# EAGLE design BlueSunOFP (EAGLE 7.6.0)

## Sheet 1 of 2
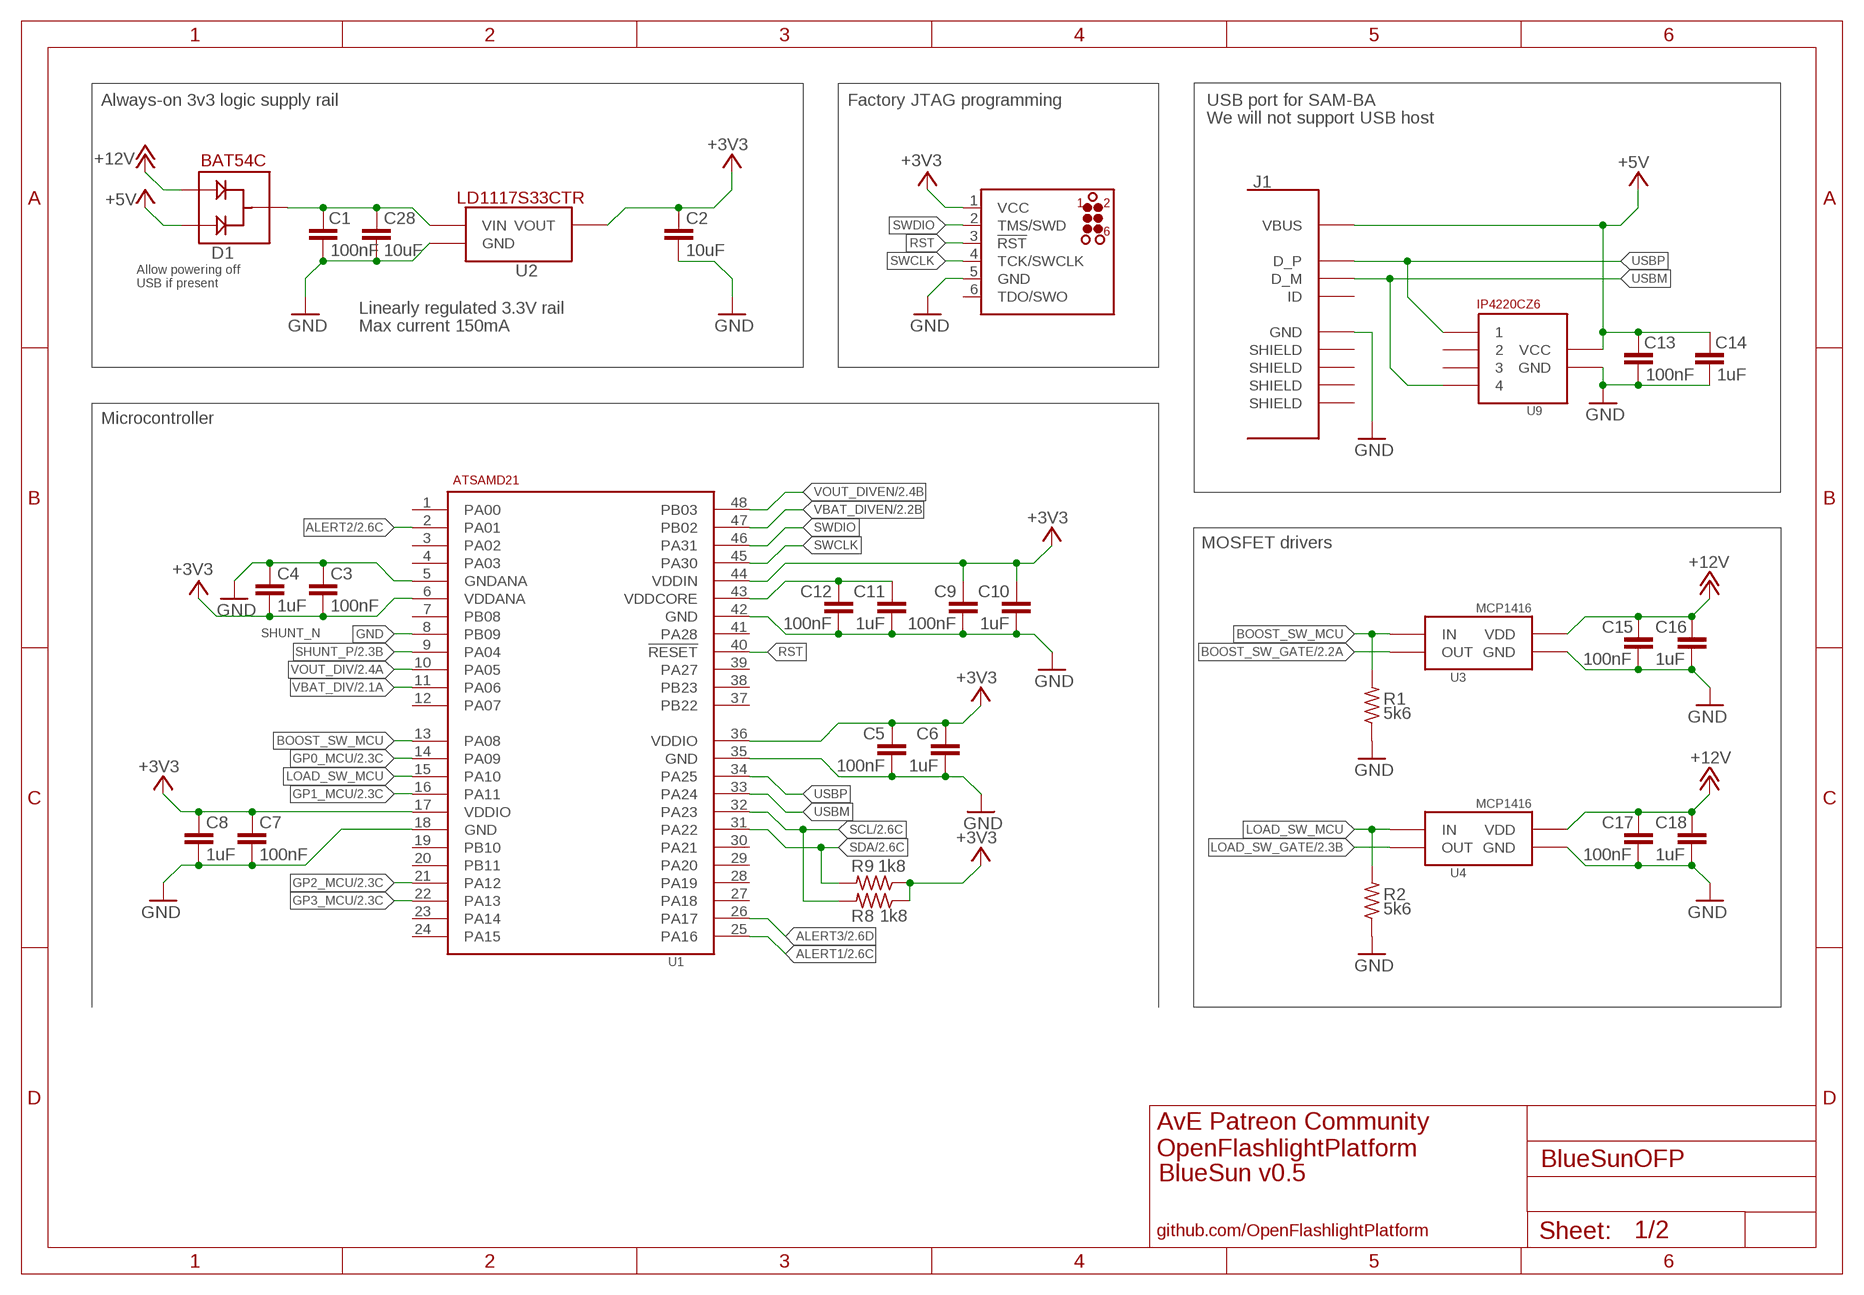
[diagram p0: schematic, sheet 1]

### Parts
C1  100nF  C-EUC0603K  [C0603K]
C2  10uF  C-EUC0603K  [C0603K]
C3  100nF  C-EUC0402K  [C0402K]
C4  1uF  C-EUC0402K  [C0402K]
C5  100nF  C-EUC0402K  [C0402K]
C6  1uF  C-EUC0402K  [C0402K]
C7  100nF  C-EUC0402K  [C0402K]
C8  1uF  C-EUC0402K  [C0402K]
C9  100nF  C-EUC0402K  [C0402K]
C10  1uF  C-EUC0402K  [C0402K]
C11  1uF  C-EUC0402K  [C0402K]
C12  100nF  C-EUC0402K  [C0402K]
C13  100nF  C-EUC0603K  [C0603K]
C14  1uF  C-EUC0603K  [C0603K]
C15  100nF  C-EUC0603K  [C0603K]
C16  1uF  C-EUC0603K  [C0603K]
C17  100nF  C-EUC0603K  [C0603K]
C18  1uF  C-EUC0603K  [C0603K]
C28  10uF  C-EUC0603K  [C0603K]
D1  BAT54C  [SOT23]
J1  USBSMT  [USB_SMT]
R1  5k6  R-US_R0603  [R0603]
R2  5k6  R-US_R0603  [R0603]
R8  1k8  R-US_R0603  [R0603]
R9  1k8  R-US_R0603  [R0603]
U1  SAMD21  [TQFP48]
U2  LD1117S33CTR_3V3_REG  [SOT223]
U3  MCP1416  [SOT23-5]
U4  MCP1416  [SOT23-5]
U9  IP4220CZ6  [SOT457]
U$1  JLINK_CONNECT  [TC2030-MCP-NL]

### Nets
+3V3: C2.1 C3.2 C4.2 C5.1 C6.1 C7.1 C8.1 C9.1 C10.1 R8.1 R9.1 U1.6(VDDANA) U1.17(VDDIO) U1.36(VDDIO) U1.44(VDDIN) U2.2(VOUT) U$1.1(VCC) ; also sheet 2
+5V: C13.1 C14.1 D1.2 J1.1VBUS(VBUS) U9.5(VCC)
+12V: C15.1 C16.1 C17.1 C18.1 D1.1 U3.2(VDD) U4.2(VDD) ; also sheet 2
ALERT1: U1.25(PA16) ; also sheet 2
ALERT2: U1.2(PA01) ; also sheet 2
ALERT3: U1.26(PA17) ; also sheet 2
BOOST_SW_GATE: U3.5(OUT) ; also sheet 2
BOOST_SW_MCU: R1.2 U1.13(PA08) U3.3(IN)
GND: C1.2 C2.2 C3.1 C4.1 C5.2 C6.2 C7.2 C8.2 C9.2 C10.2 C11.2 C12.2 C13.2 C14.2 C15.2 C16.2 C17.2 C18.2 C28.2 J1.5GND(GND) R1.1 R2.1 U1.5(GNDANA) U1.8(PB09) U1.18(GND) U1.35(GND) U1.42(GND) U2.1(GND) U3.4(GND) U4.4(GND) U9.2(GND) U$1.5(GND) ; also sheet 2
GP0_MCU: U1.14(PA09) ; also sheet 2
GP1_MCU: U1.16(PA11) ; also sheet 2
GP2_MCU: U1.21(PA12) ; also sheet 2
GP3_MCU: U1.22(PA13) ; also sheet 2
LOAD_SW_GATE: U4.5(OUT) ; also sheet 2
LOAD_SW_MCU: R2.2 U1.15(PA10) U4.3(IN)
N$1: C11.1 C12.1 U1.43(VDDCORE)
N$2: C1.1 C28.1 D1.3(NEG) U2.3(VIN)
RST: U1.40(!RESET!) U$1.3(!RST!)
SCL: R8.2 U1.32(PA23) ; also sheet 2
SDA: R9.2 U1.31(PA22) ; also sheet 2
SHUNT_P: U1.9(PA04) ; also sheet 2
SWCLK: U1.45(PA30) U$1.4(TCK/SWCLK)
SWDIO: U1.46(PA31) U$1.2(TMS/SWD)
USBM: J1.2D-(D_M) U1.33(PA24) U9.6
USBP: J1.3D+(D_P) U1.34(PA25) U9.1
VBAT_DIV: U1.11(PA06) ; also sheet 2
VBAT_DIVEN: U1.47(PB02) ; also sheet 2
VOUT_DIV: U1.10(PA05) ; also sheet 2
VOUT_DIVEN: U1.48(PB03) ; also sheet 2
Unconnected: J1.4ID(ID) J1.SHIELD@1(SHIELD) J1.SHIELD@2(SHIELD) J1.SHIELD@3(SHIELD) J1.SHIELD@4(SHIELD) U1.1(PA00) U1.3(PA02) U1.4(PA03) U1.7(PB08) U1.12(PA07) U1.19(PB10) U1.20(PB11) U1.23(PA14) U1.24(PA15) U1.27(PA18) U1.28(PA19) U1.29(PA20) U1.30(PA21) U1.37(PB22) U1.38(PB23) U1.39(PA27) U1.41(PA28) U9.3 U9.4 U$1.6(TDO/SWO)

### Notes on the sheet
- Always-on 3v3 logic supply rail | Factory JTAG programming | USB port for SAM-BA
- We will not support USB host
- Allow powering off
  USB if present
- Linearly regulated 3.3V rail
- Max current 150mA
- Microcontroller
- MOSFET drivers
- SHUNT_N
- AvE Patreon Community
- OpenFlashlightPlatform
- BlueSun v0.5
- github.com/OpenFlashlightPlatform

## Sheet 2 of 2
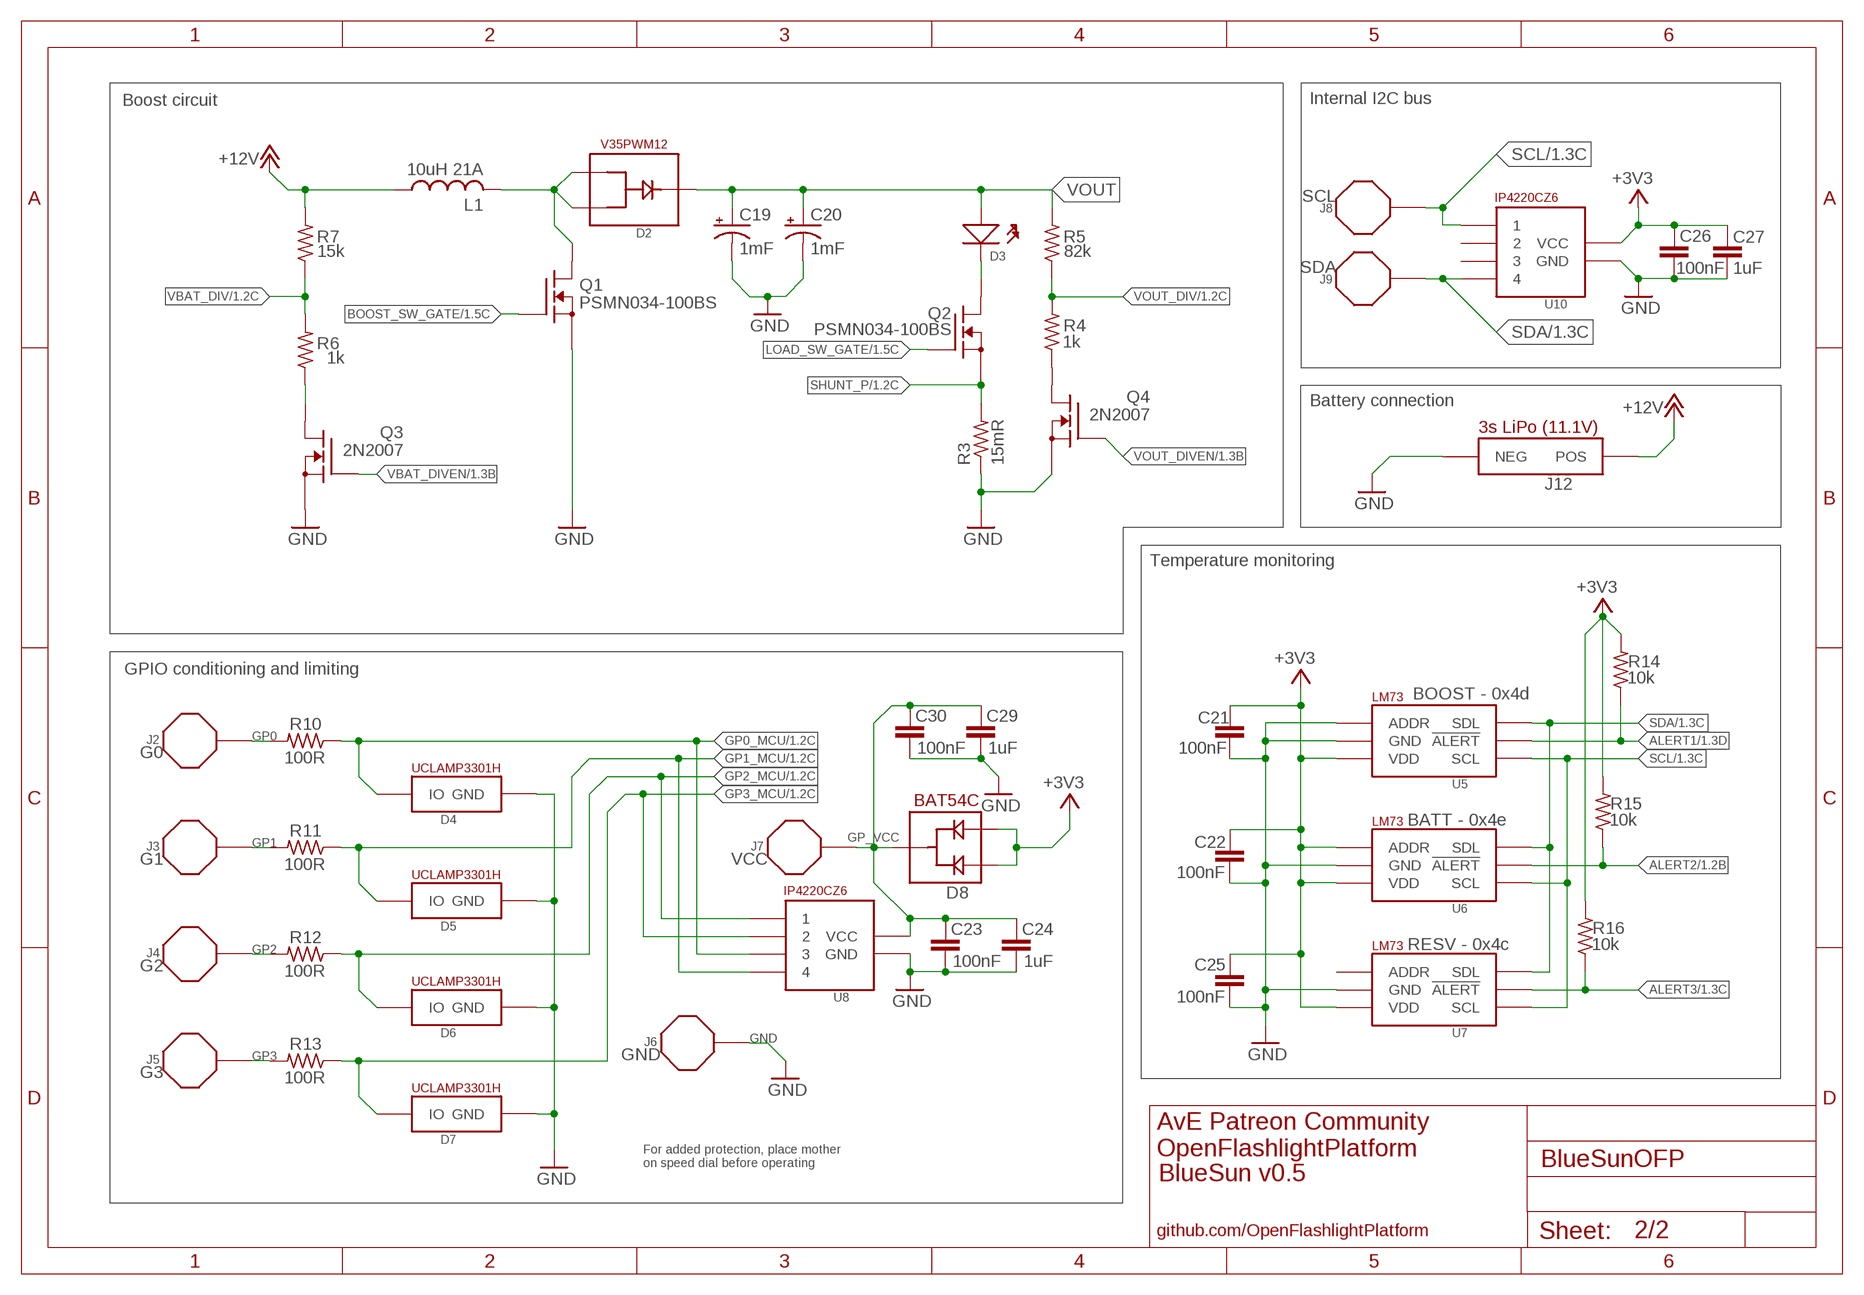
[diagram p1: schematic, sheet 2]

### Parts
C19  1mF  10MMCAP  [10MMCAP]
C20  1mF  10MMCAP  [10MMCAP]
C21  100nF  C-EUC0603K  [C0603K]
C22  100nF  C-EUC0603K  [C0603K]
C23  100nF  C-EUC0603K  [C0603K]
C24  1uF  C-EUC0603K  [C0603K]
C25  100nF  C-EUC0603K  [C0603K]
C26  100nF  C-EUC0603K  [C0603K]
C27  1uF  C-EUC0603K  [C0603K]
C29  1uF  C-EUC0603K  [C0603K]
C30  100nF  C-EUC0603K  [C0603K]
D2  DIODE  [SLIMPAK]
D3  CREE_COB  [CREE_WIRE_MOUNT]
D4  UCLAMP3301H  [SOD523]
D5  UCLAMP3301H  [SOD523]
D6  UCLAMP3301H  [SOD523]
D7  UCLAMP3301H  [SOD523]
D8  BAT54C  [SOT23]
J2  G0  EXT_PIN  [EXT_PIN]
J3  G1  EXT_PIN  [EXT_PIN]
J4  G2  EXT_PIN  [EXT_PIN]
J5  G3  EXT_PIN  [EXT_PIN]
J6  GND  EXT_PIN  [EXT_PIN]
J7  VCC  EXT_PIN  [EXT_PIN]
J8  SCL  EXT_PIN  [EXT_PIN]
J9  SDA  EXT_PIN  [EXT_PIN]
J12  BATTERY  [CREE_WIRE_MOUNT]
L1  10uH 21A  INDUCTOR  [INDUCTOR]
Q1  PSMN034-100BS  MOSFET  [D2PAK]
Q2  PSMN034-100BS  MOSFET  [D2PAK]
Q3  2N2007  SMALL_MOSFET  [SOT23]
Q4  2N2007  SMALL_MOSFET  [SOT23]
R3  15mR  R-US_R2512  [R2512]
R4  1k  R-US_R0603  [R0603]
R5  82k  R-US_R0603  [R0603]
R6  1k  R-US_R0603  [R0603]
R7  15k  R-US_R0603  [R0603]
R10  100R  R-US_R0603  [R0603]
R11  100R  R-US_R0603  [R0603]
R12  100R  R-US_R0603  [R0603]
R13  100R  R-US_R0603  [R0603]
R14  10k  R-US_R0603  [R0603]
R15  10k  R-US_R0603  [R0603]
R16  10k  R-US_R0603  [R0603]
U5  LM73  [SOT23-6]
U6  LM73  [SOT23-6]
U7  LM73  [SOT23-6]
U8  IP4220CZ6  [SOT457]
U10  IP4220CZ6  [SOT457]

### Nets
+3V3: C21.1 C22.1 C25.1 C26.1 C27.1 D8.1 D8.2 R14.2 R15.2 R16.2 U5.3(VDD) U6.1(ADDR) U6.3(VDD) U7.3(VDD) U10.5(VCC) ; also sheet 1
+12V: J12.POS L1.P$1 R7.2 ; also sheet 1
ALERT1: R14.1 U5.5(!ALERT!) ; also sheet 1
ALERT2: R15.1 U6.5(!ALERT!) ; also sheet 1
ALERT3: R16.1 U7.5(!ALERT!) ; also sheet 1
BOOST_SW_GATE: Q1.1(G) ; also sheet 1
GND: C19.NEG(-) C20.NEG(-) C21.2 C22.2 C23.2 C24.2 C25.2 C26.2 C27.2 C29.2 C30.2 D4.NOLINE(GND) D5.NOLINE(GND) D6.NOLINE(GND) D7.NOLINE(GND) J6.P$1 J12.NEG Q1.3(S) Q3.2(S) Q4.2(S) R3.1 U5.1(ADDR) U5.2(GND) U6.2(GND) U7.2(GND) U8.2(GND) U10.2(GND) ; also sheet 1
GP0: J2.P$1 R10.2
GP0_MCU: D4.LINE(IO) R10.1 U8.4 ; also sheet 1
GP1: J3.P$1 R11.2
GP1_MCU: D5.LINE(IO) R11.1 U8.6 ; also sheet 1
GP2: J4.P$1 R12.2
GP2_MCU: D6.LINE(IO) R12.1 U8.1 ; also sheet 1
GP3: J5.P$1 R13.2
GP3_MCU: D7.LINE(IO) R13.1 U8.3 ; also sheet 1
GP_VCC: C23.1 C24.1 C29.1 C30.1 D8.3(NEG) J7.P$1 U8.5(VCC)
LOAD_SW_GATE: Q2.1(G) ; also sheet 1
N$3: D2.1 D2.2 L1.P$2 Q1.2(D)
N$5: D3.NEG Q2.2(D)
N$6: Q3.3(D) R6.1
N$7: Q4.3(D) R4.1
SCL: J8.P$1 U5.4(SCL) U6.4(SCL) U7.4(SCL) U10.1 ; also sheet 1
SDA: J9.P$1 U5.6(SDL) U6.6(SDL) U7.6(SDL) U10.6 ; also sheet 1
SHUNT_P: Q2.3(S) R3.2 ; also sheet 1
VBAT_DIV: R6.2 R7.1 ; also sheet 1
VBAT_DIVEN: Q3.1(G) ; also sheet 1
VOUT: C19.POS(+) C20.POS(+) D2.K D3.POS R5.2
VOUT_DIV: R4.2 R5.1 ; also sheet 1
VOUT_DIVEN: Q4.1(G) ; also sheet 1
Unconnected: U7.1(ADDR) U10.3 U10.4

### Notes on the sheet
- Boost circuit | Internal I2C bus
- Battery connection
- Temperature monitoring
- GPIO conditioning and limiting
- BOOST - 0x4d
- BATT - 0x4e
- RESV - 0x4c
- AvE Patreon Community
- OpenFlashlightPlatform
- For added protection, place mother
  on speed dial before operating
- BlueSun v0.5
- github.com/OpenFlashlightPlatform

## Library data of the parts
C1-C18 C21-C30 = rcl:C-EU: CAPACITOR, European symbol
C19 C20 = flashlight:10MMCAP
D1 D8 = flashlight:BAT54C
D2 = flashlight:DIODE
D3 = flashlight:CREE_COB
D4-D7 = flashlight:UCLAMP3301H
J1 = flashlight:USB
J2-J9 = flashlight:EXT_PIN
J12 = flashlight:BATTERY
L1 = flashlight:INDUCTOR
Q1 Q2 = flashlight:MOSFET
Q3 Q4 = flashlight:SMALL_MOSFET
R1-R16 = rcl:R-US_: RESISTOR, American symbol
U1 = flashlight:SAMD21
U2 = flashlight:LD1117S33CTR_3V3_REG
U3 U4 = flashlight:MCP1416
U5-U7 = flashlight:LM73
U8-U10 = flashlight:IP4220CZ6
U$1 = flashlight:JLINK_CONNECT

## Board
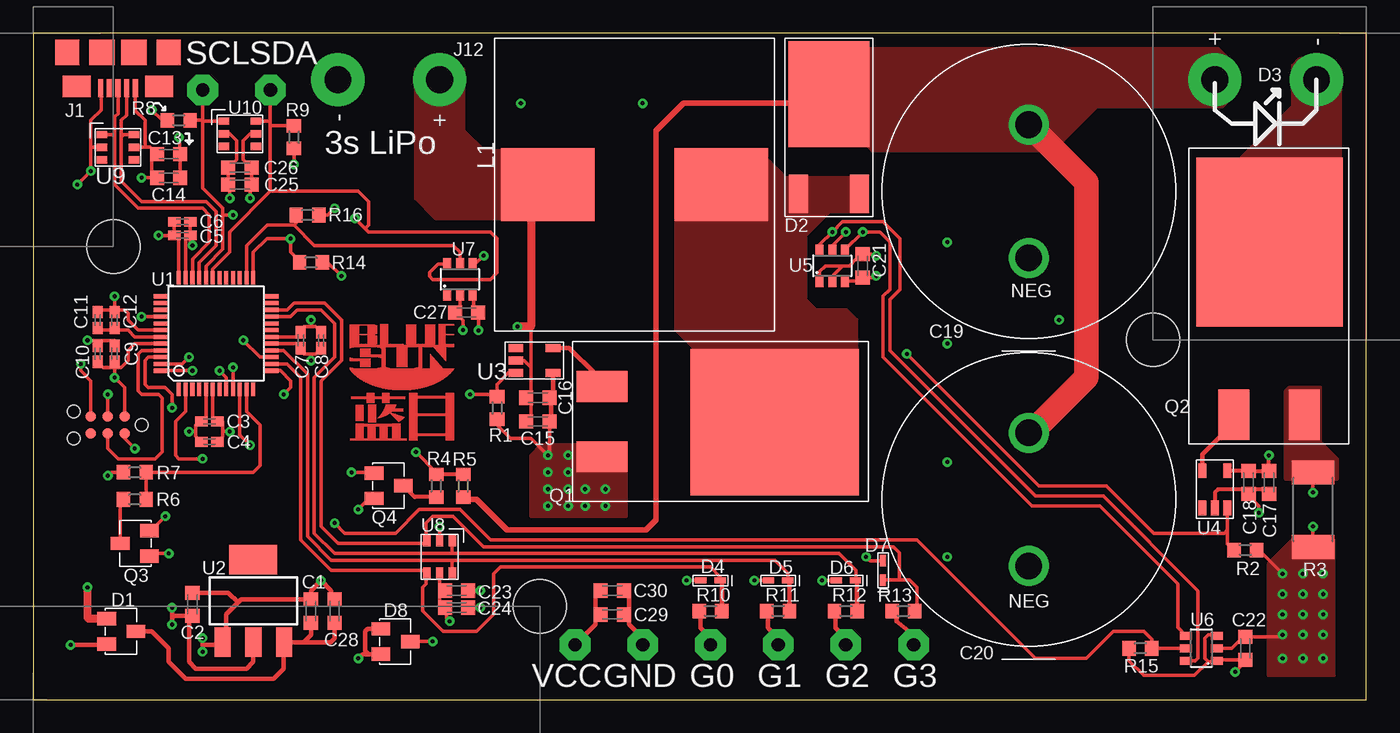
[diagram p2: board, top side]
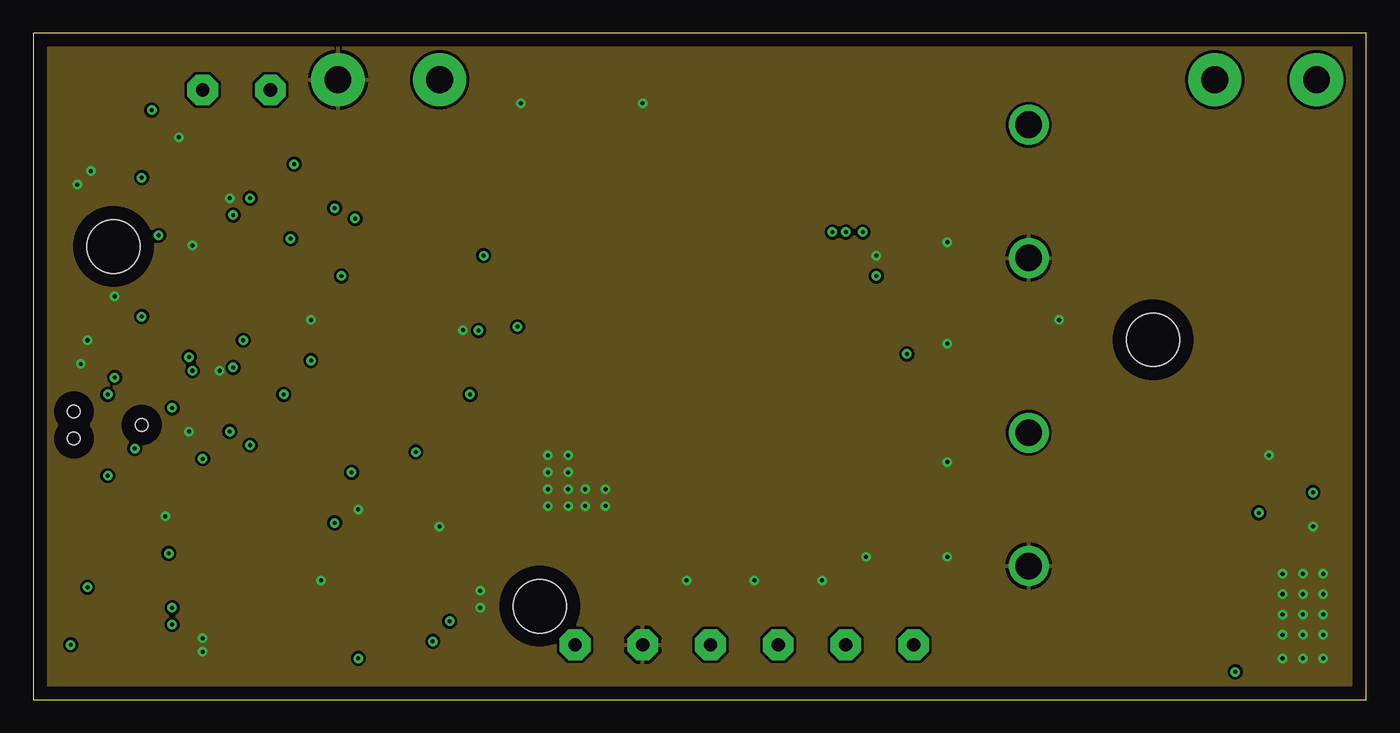
[diagram p3: board, inner layer Route2]
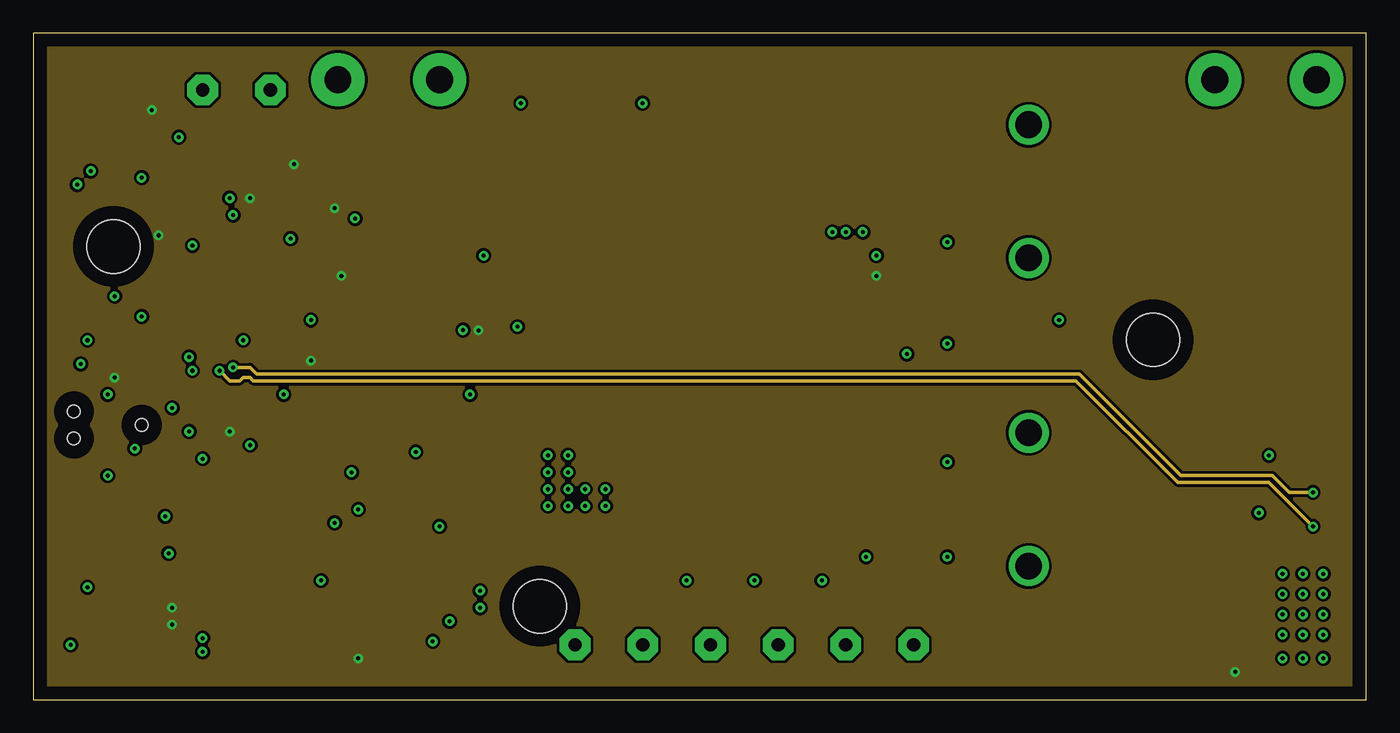
[diagram p4: board, inner layer Route15]
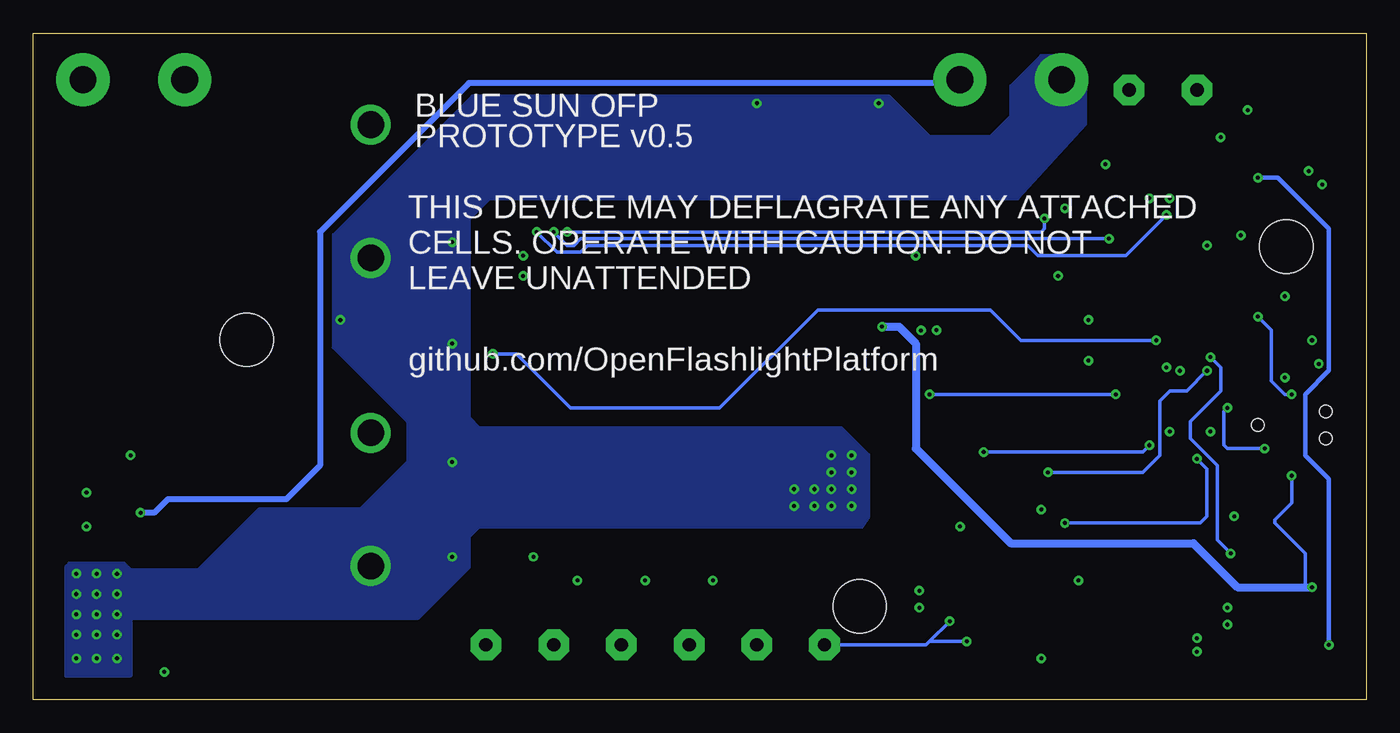
[diagram p5: board, bottom side, seen from below]

Size 100 x 50 mm. Coordinates in mm from the lower left corner, seen from the top.
Outline: 0,0 100,0 100,50 0,50 0,0
Copper layers (1*2*15*16): Top 0.035mm / dielectric 1.5mm / Route2 0.035mm / dielectric 0.15mm / Route15 0.035mm / dielectric 0.2mm / Bottom 0.035mm
Design rules "default *": minimum track width 10mil, minimum drill 12mil, track to track 8mil, track to pad 8mil, pad to pad 8mil, via to via 8mil, smd to smd 0mil, copper to edge 40mil, drill to drill 8mil, minimum pad ring 10mil, minimum via ring 8mil, stop-mask expansion 4mil, vias tented up to drill 12mil, thermal gap 10mil
Holes 4 mm at 6,34 38,7 84,27

### Footprints (pad centres in the part's own frame; a part is rotated, then mirrored left to right if it is on the bottom)
C0603K = smd 1.05 x 1.08: 1 -0.875,0; 2 0.875,0
C0402K = smd 0.925 x 0.74: 1 -0.6,0; 2 0.6,0
10MMCAP = drill 2: NEG 5,0; POS -5,0
SOT23 = smd 1 x 1.4: 1 -0.95,-1.1; 2 0.95,-1.1; 3 0,1.1
SLIMPAK = smd 1.4 x 2.9: 1 -2.29,-3.48; 2 2.29,-3.48 | smd 6.1 x 7.97: K 0,4
CREE_WIRE_MOUNT = drill 2 pad 4: NEG 0,-7.62; POS 0,0
SOD523 = smd 0.85 x 0.45: LINE -0.725,0; NOLINE 0.725,0
USB_SMT = smd 0.4 x 1.35: 1VBUS -1.3,2.675; 2D- -0.65,2.675; 3D+ 0,2.675; 4ID 0.65,2.675; 5GND 1.3,2.675 | smd 2.1 x 1.6: SHIELD@1 -3.1,2.55; SHIELD@6 3.1,2.55 | smd 1.8 x 1.9: SHIELD@2 -3.8,0; SHIELD@5 3.8,0 | smd 1.9 x 1.9: SHIELD@3 -1.2,0; SHIELD@4 1.2,0
EXT_PIN = drill 1 pad 2.3 octagon: P$1 0,0
INDUCTOR = smd 5.5 x 7: P$1 0,0; P$2 0,13
D2PAK = smd 2.32 x 3.81: 1 -2.64,0; 3 2.64,0 | smd 11 x 12.65: 2 0.05,12.953
R0603 = smd 1 x 1.1: 1 -0.85,0; 2 0.85,0
R2512 = smd 1.8 x 3.2: 1 -2.8,0; 2 2.8,0
TQFP48 = smd 1.016 x 0.305: 1 -4.191,2.794; 2 -4.191,2.286; 3 -4.191,1.778; 4 -4.191,1.27; 5 -4.191,0.762; 6 -4.191,0.254; 7 -4.191,-0.254; 8 -4.191,-0.762; 9 -4.191,-1.27; 10 -4.191,-1.778; 11 -4.191,-2.286; 12 -4.191,-2.794; 25 4.191,-2.794; 26 4.191,-2.286; 27 4.191,-1.778; 28 4.191,-1.27; 29 4.191,-0.762; 30 4.191,-0.254; 31 4.191,0.254; 32 4.191,0.762; 33 4.191,1.27; 34 4.191,1.778; 35 4.191,2.286; 36 4.191,2.794 | smd 0.305 x 1.016: 13 -2.794,-4.191; 14 -2.286,-4.191; 15 -1.778,-4.191; 16 -1.27,-4.191; 17 -0.762,-4.191; 18 -0.254,-4.191; 19 0.254,-4.191; 20 0.762,-4.191; 21 1.27,-4.191; 22 1.778,-4.191; 23 2.286,-4.191; 24 2.794,-4.191; 37 2.794,4.191; 38 2.286,4.191; 39 1.778,4.191; 40 1.27,4.191; 41 0.762,4.191; 42 0.254,4.191; 43 -0.254,4.191; 44 -0.762,4.191; 45 -1.27,4.191; 46 -1.778,4.191; 47 -2.286,4.191; 48 -2.794,4.191
SOT223 = smd 1.219 x 2.235: 1 -2.311,-3.099; 2 0,-3.099; 3 2.311,-3.099 | smd 3.6 x 2.2: 4 0,3.099
SOT23-5 = smd 0.6 x 1.1: 1 -0.95,-1.4; 2 0,-1.4; 3 0.95,-1.4; 4 0.95,1.4; 5 -0.95,1.4
SOT23-6 = smd 0.6 x 0.9: 1 -0.95,-1.15; 2 0,-1.15; 3 0.95,-1.15; 4 0.95,1.15; 5 0,1.15; 6 -0.95,1.15
SOT457 = smd 0.8 x 0.55: 1 -1.2,0.95; 2 -1.2,0; 3 -1.2,-0.95; 4 1.2,-0.95; 5 1.2,0; 6 1.2,0.95
TC2030-MCP-NL = smd 0.787 x 0.787: 1 1.27,-0.635; 2 1.27,0.635; 3 2.54,-0.635; 4 2.54,0.635; 5 3.81,-0.635; 6 3.81,0.635 | hole 0.95: 0,0; 5.08,-1.016; 5.08,1.016

### Placement (x,y rotation side)
C1  20.83,6.64 90 top
C2  11.94,7.15 90 top
C3  13.21,20.87 0 top
C4  13.21,19.34 0 top
C5  11.18,34.84 0 top
C6  11.18,35.85 0 top
C7  20.07,26.96 90 top
C8  21.59,26.96 90 top
C9  6.1,25.95 90 top
C10  4.83,25.95 90 top
C11  4.83,28.49 90 top
C12  6.1,28.49 90 top
C13  10.16,40.93 0 top
C14  10.16,39.15 0 top
C15  37.85,20.87 0 top
C16  37.85,22.64 0 top
C17  92.71,16.29 90 top
C18  91.19,16.29 90 top
C19  74.68,38.14 270 top
C20  74.68,15.02 270 top
C21  62.23,32.55 90 top
C22  90.93,3.85 90 top
C23  31.75,8.17 0 top
C24  31.75,6.9 0 top
C25  15.49,38.65 180 top
C26  15.49,39.92 180 top
C27  32.51,29.04 180 top
C28  22.61,6.64 90 top
C29  43.43,6.39 0 top
C30  43.43,8.17 0 top
D1  6.6,5.12 270 top
D2  59.69,41.44 0 top
D3  88.65,46.52 90 top
D4  50.8,8.93 180 top
D5  55.88,8.93 180 top
D6  60.96,8.93 180 top
D7  63.75,9.69 90 top
D8  27.18,4.36 270 top
J1  6.35,48.55 180 top
J2  50.8,4.1 90 top
J3  55.88,4.1 90 top
J4  60.96,4.1 90 top
J5  66.04,4.1 90 top
J6  45.72,4.1 90 top
J7  40.64,4.1 90 top
J8  12.7,45.76 90 top
J9  17.78,45.76 90 top
J12  30.48,46.52 270 top
L1  38.61,38.65 270 top
Q1  42.67,20.87 270 top
Q2  92.71,21.37 0 top
Q3  7.62,11.72 90 top
Q4  26.67,16.04 270 top
R1  34.8,21.88 90 top
R2  90.93,11.21 180 top
R3  96.01,14.26 90 top
R4  30.23,16.04 90 top
R5  32.26,16.04 270 top
R6  7.62,15.02 0 top
R7  7.62,17.06 180 top
R8  10.92,43.47 0 top
R9  19.56,42.2 90 top
R10  50.8,6.64 180 top
R11  55.88,6.64 180 top
R12  60.96,6.64 180 top
R13  65.28,6.64 180 top
R14  20.83,32.8 0 top
R15  83.06,3.85 180 top
R16  20.57,36.36 0 top
U1  13.72,27.47 90 top
U2  16.51,7.4 0 top
U3  37.59,25.44 270 top
U4  88.65,15.79 0 top
U5  59.94,32.55 0 top
U6  87.63,3.85 90 top
U7  32,31.53 0 top
U8  30.48,10.71 270 top
U9  6.35,41.44 0 top
U10  15.49,42.46 0 top
U$1  8.13,20.61 180 top

### Tracks (layer width: path | path; a pad name or v marks a point on that pad's centre or on a via)
+3V3  (via drill 0.3)
  Top 0.254: 14.22,20.1 14.22,20.87 C3.2 13.46,21.21 U1.6 | 14.22,20.1 14.22,19.76 C4.2 | v14.73,20.1 14.22,20.1 | U1.44 7.62,26.71 7.11,26.2 7.11,25.44 6.6,24.93 6.1,24.93 | 6.1,24.93 5.24,24.93 C10.1 | 6.1,24.93 C9.1 v6.1,24.17 6.86,23.41 U$1.1 | U1.17 19.72,26.71 C7.1 20.07,26.2 20.32,25.95 20.83,25.95 | 20.83,25.95 21.17,25.95 C8.1 | v20.83,25.44 20.83,25.95 | U1.36 10.92,34.84 C5.1 | U5.3 61.95,31.4 C21.1 63.13,31.67 v63.25,31.79 | 88.14,2.83 88.71,2.83 U6.1 88.86,2.97 C22.1 90.93,2.83 v90.17,2.07 | R15.2 82.21,2.92 83.31,1.82 87.12,1.82 88.14,2.83 | 88.14,2.83 87.88,3.09 87.88,4.61 88.14,4.86 88.71,4.86 U6.3 | U10.5 16.26,42.46 15.75,41.95 15.75,40.54 C26.1 C25.1 16.26,38.53 v16.26,37.63 | C5.1 v9.4,34.84 | C5.1 C6.1 | R8.1 9.65,43.47 v8.89,44.23 | R9.1 v19.56,40.17 | U7.3 33.02,30.32 33.02,28.99 33.27,28.74 C27.1 33.4,28.6 v33.4,27.7 | R14.2 22.1,32.8 v23.11,31.79 | R16.2 22.1,36.36 v22.61,36.87
  Top 0.356: U2.2 16.51,2.83 16,2.32 12.19,2.32 11.68,2.83 11.68,6.02 C2.1 10.55,6.27 10.41,6.13 | 10.41,6.13 v10.41,5.63 | 10.41,6.13 v10.41,6.9 | D8.2 25.15,3.41 | 25.15,3.41 24.7,3.41 v24.38,3.09 | D8.1 25.08,5.31 24.89,5.12 24.89,3.66 25.15,3.41
  pour Route15: 0.25,49.82 100.08,50.08 100.84,0.04 0.25,0.04
+5V  (via drill 0.3)
  Top 0.254: J1.1VBUS 7.65,44.2 8.38,43.47 8.38,41.44 U9.5 8.78,41.44 C13.1 9.29,40.82 8.89,40.42 8.89,39.55 C14.1 v8.13,39.15
  Top 0.356: v2.79,4.1 5.44,4.1 D1.2
  Bottom 0.356: v8.13,39.15 6.62,39.15 2.79,35.33 2.79,24.68 4.57,22.9 4.57,18.33 2.79,16.55 v2.79,4.1
+12V  (via drill 0.3)
  Top 0.254: 90.68,15.79 91.95,14.52 v91.95,14.01 | U3.2 36.83,25.44 37.34,24.93 | 37.34,24.93 37.34,23.01 C16.1 37.34,22.64 37.34,21.23 C15.1 | L1.P$1 38.61,37.38 37.59,36.36 37.34,36.36 37.08,36.11 | 37.34,27.98 37.34,24.93 | R7.2 5.84,17.06 v5.59,16.8
  Top 0.305: U4.2 88.65,15.53 88.9,15.79 90.68,15.79 91.05,15.42 C18.1 91.55,15.79 92.46,15.79 92.71,15.53 C17.1
  Top 0.61: 37.34,36.36 37.34,27.98 v36.32,27.98 | D1.1 4.13,6.07 4.06,6.13 v4.06,8.42
  Bottom 0.254: v5.59,16.8 5.59,14.77 6.86,13.5 6.86,13.25 4.57,10.96 4.57,8.42 | 30.48,46.27 J12.POS
  Bottom 0.457: 30.48,46.27 67.31,46.27 78.49,35.09 78.49,17.56 81.03,15.02 89.92,15.02 90.93,14.01 v91.95,14.01
  Bottom 0.61: v36.32,27.98 35.05,27.98 33.78,26.71 33.78,18.83 26.67,11.72 12.95,11.72 9.65,8.42 4.57,8.42 v4.06,8.42
  pour Top (no thermals): 29.46,48.04 31.5,48.04 32.26,47.28 32.26,42.71 33.78,41.19 41.4,41.19 41.91,40.68 41.91,36.61 41.4,36.11 30.23,36.11 28.7,37.63 28.7,47.28
ALERT1  (via drill 0.3)
  Top 0.254: U5.5 59.94,34.07 v60.96,35.09 | U1.25 16.51,33.57 17.53,34.58 v19.3,34.58 19.3,33.57 19.98,32.89 R14.1
  Bottom 0.254: v60.96,35.09 59.94,34.07 59.44,34.07 58.93,34.58 v19.3,34.58
ALERT2  (via drill 0.3)
  Top 0.254: U6.5 R15.1 83.91,4.52 83.31,5.12 81.03,5.12 78.99,3.09 75.18,3.09 66.29,11.98 34.29,11.98 32,14.26 28.96,14.26 27.18,12.48 23.37,12.48 v22.61,13.25 | v12.7,18.07 10.92,18.07 10.67,18.33 10.67,20.87 11.43,21.63 U1.2
  Bottom 0.254: v22.61,13.25 12.45,13.25 11.94,13.75 11.94,17.31 v12.7,18.07
ALERT3
  Top 0.254: U1.26 16,34.07 17.53,35.6 19.56,35.6 | U7.5 32,33.57 31.5,34.07 21.08,34.07 19.56,35.6 | R16.1 19.72,35.76 19.56,35.6
BOOST_SW_GATE
  Top 0.356: U3.5 40.2,26.39 42.16,24.42 42.16,24.01 Q1.1
BOOST_SW_MCU  (via drill 0.3)
  Top 0.254: U3.3 35.63,24.49 34.8,23.66 R1.2 34.63,22.9 v32.77,22.9 | U1.13 18.54,24.68 19.3,23.91 19.3,23.41 v18.8,22.9
  Bottom 0.254: v18.8,22.9 v32.77,22.9
GND  (via drill 0.3)
  Top 0.254: 12.19,20.1 12.19,19.76 C4.1 | v11.68,20.1 12.19,20.1 | U1.42 7.87,27.72 7.11,28.49 7.11,28.99 6.86,29.25 6.1,29.25 | 6.1,29.25 4.99,29.25 C11.2 | C12.2 6.1,29.25 | 6.1,29.25 v6.1,30.26 | C9.2 6.1,26.96 4.83,26.96 | 4.83,26.96 v4.06,26.96 | C10.2 4.83,26.96 | U$1.5 4.32,23.91 3.56,24.68 v3.56,25.18 | U1.5 12.95,21.21 C3.1 | C3.1 12.7,20.87 | C3.1 12.45,20.87 12.19,20.61 12.19,20.1 | U1.18 19.72,27.22 C7.2 20.07,27.72 20.32,27.98 20.83,27.98 | 20.83,27.98 21.17,27.98 C8.2 | v20.83,28.49 20.83,27.98 | U1.35 11.43,34.49 C5.2 | U5.2 59.94,31.79 60.71,32.55 | 60.71,32.55 61.21,32.55 61.72,33.06 61.86,33.06 C21.2 62.88,33.42 62.99,33.31 v63.25,33.31 | U5.1 58.99,32.11 59.44,32.55 60.71,32.55 | R2.1 91.95,11.21 v93.73,9.44 | U6.2 89.92,3.85 90.79,4.72 C22.2 93.58,4.72 v93.73,4.86 | R1.1 34.8,20.61 35.81,19.6 37.34,19.6 v38.61,18.33 38.72,18.44 C15.2 | U8.2 v30.48,12.99 | C23.2 v33.53,8.17 | C24.2 v33.53,6.9 | D4.NOLINE v49.02,8.93 | D5.NOLINE v54.1,8.93 | D6.NOLINE v59.18,8.93 | J1.5GND 5.05,45.53 5.08,45.5 5.08,44.23 4.32,43.47 4.32,41.44 | U9.2 4.32,41.44 | 4.32,41.44 v4.32,39.66 v3.3,38.65 | v10.92,42.2 11.04,41.33 C13.2 C14.2 | Q3.2 8.82,12.67 v9.91,13.75 | Q4.2 25.21,15.09 v24.38,14.26 | U10.2 14.73,42.46 15.24,41.95 15.24,40.54 C26.2 C25.2 14.73,38.53 v14.73,37.63 | C5.2 11.78,34.24 v11.94,34.07 | C5.2 C6.2 | U7.2 32,28.99 31.89,28.99 C27.2 32.23,28.45 v32.23,27.72 | D7.NOLINE 62.77,10.41 v62.48,10.71 | U1.8 14.48,24.17 v13.97,24.68 | v96.01,12.99 R3.1
  Top 0.305: U4.4 91.17,17.19 C18.2 C17.2 v92.71,18.33
  Top 0.356: U3.4 38.99,22.92 C16.2 | C16.2 38.72,22.53 38.86,22.39 | C15.2 38.72,20.98 38.86,21.12 38.86,22.5 C16.2 | 12.7,4.1 13.97,4.1 14.2,3.82 U2.1 14.48,4.59 14.48,6.39 15.37,7.28 | 12.7,4.1 v12.7,4.61 | 12.7,4.1 v12.7,3.59 | 15.37,7.28 15.61,7.52 C1.2 20.83,8.17 v21.59,8.93 22.35,8.17 22.35,7.77 C28.2 | C2.2 14.62,8.02 15.37,7.28 | J6.P$1 45.72,4.61 44.7,5.63 44.7,6.39 | 44.7,6.39 44.7,7.77 C30.2 | C29.2 44.7,6.39
  Route15 0.254: v13.97,24.68 14.73,23.91 15.49,23.91 15.75,24.17 16.26,24.17 16.51,23.91 78.23,23.91 85.85,16.29 92.71,16.29 v96.01,12.99
  other vias: 95.25,9.44 96.77,9.44 96.77,7.91 95.25,7.91 93.73,7.91 93.73,6.39 93.73,3.09 95.25,3.09 96.77,3.09 96.77,4.86 95.25,4.86 95.25,6.39 96.77,6.39 36.58,44.74 45.72,44.74 68.58,34.33 68.58,26.71 68.58,17.82 68.58,10.71 76.96,28.49 40.13,18.33 38.61,17.06 40.13,17.06 38.61,15.79 38.61,14.52 40.13,14.52 41.4,14.52 42.93,14.52 42.93,15.79 41.4,15.79 40.13,15.79
  pour Route2: 0.25,49.82 100.08,50.08 100.08,0.04 -0.07,-0.01
  pour Top (no thermals): 94.49,11.98 97.54,11.98 97.54,1.82 92.71,1.82 92.71,10.2
  pour Bottom: 92.71,7.91 92.71,9.69 93.22,10.2 97.28,10.2 97.54,9.94 97.54,1.82 92.71,1.82
  pour Bottom (no thermals): 26.67,46.01 26.67,43.73 28.19,42.2 32.77,42.2 35.81,45.25 67.06,45.25 77.47,34.84 77.47,26.45 71.88,20.87 71.88,17.82 75.44,14.26 83.06,14.26 87.63,9.69 97.54,9.69 97.54,1.82 92.71,1.82 92.71,6.13 71.12,6.13 67.31,9.94 67.31,12.23 66.55,12.99 37.85,12.99 37.34,13.75 37.34,18.33 39.37,20.36 66.55,20.36 67.31,21.12 67.31,36.11 65.79,37.63 26.16,37.63 21.08,43.22 21.08,47.03 22.35,48.3 24.38,48.3
  pour Top (no thermals): 40.89,19.09 44.45,19.09 44.45,17.31 44.45,13.75 37.34,13.75 37.34,18.33 38.1,19.09
GP0
  Top 0.356: J2.P$1 50.8,4.61 50.04,5.37 50.04,6.55 R10.2
GP0_MCU
  Top 0.254: D4.LINE 51.52,9.22 50.8,9.94 35.05,9.94 34.54,9.44 34.54,6.39 33.27,5.12 30.73,5.12 29.21,6.64 29.21,8.42 29.46,8.67 29.46,9.44 U8.4 29.53,9.62 29.46,9.69 22.35,9.69 20.07,11.98 20.07,24.17 19.05,25.18 U1.14
  Top 0.356: R10.1 51.65,8.8 D4.LINE
GP1
  Top 0.356: J3.P$1 55.88,4.61 55.12,5.37 55.12,6.55 R11.2
GP1_MCU
  Top 0.254: D5.LINE 56.6,9.47 55.63,10.45 31.5,10.45 | U8.6 31.43,10.39 31.5,10.45 | 31.5,10.45 22.35,10.45 20.57,12.23 20.57,24.42 18.8,26.2 U1.16
  Top 0.356: R11.1 56.73,8.8 D5.LINE
GP2
  Top 0.356: J4.P$1 60.96,4.61 60.2,5.37 60.2,6.55 R12.2
GP2_MCU
  Top 0.254: R12.1 61.81,8.84 61.72,8.93 61.72,9.69 60.45,10.96 31.5,10.96 | U8.1 31.43,11.03 31.5,10.96 | U1.21 19.3,28.74 19.81,29.25 21.59,29.25 22.61,28.23 22.61,25.69 21.08,24.17 21.08,12.48 22.61,10.96 31.5,10.96
  Top 0.356: R12.1 61.81,8.8 D6.LINE
GP3
  Top 0.356: J5.P$1 66.04,4.86 64.77,5.88 64.77,6.55 R13.2
GP3_MCU
  Top 0.254: 29.46,11.72 29.46,13.25 29.97,13.75 31.5,13.75 33.78,11.47 64.52,11.47 64.99,11 64.99,9 65.02,8.97 | 29.46,11.72 U8.3 29.53,11.79 29.46,11.72 | U1.22 19.05,29.25 19.56,29.76 21.84,29.76 23.11,28.49 23.11,25.44 21.59,23.91 21.59,12.99 22.86,11.72 29.46,11.72 | D7.LINE 65.02,8.97 | 65.02,8.97 65.75,8.97 66.29,8.42 66.29,6.81 R13.1
GP_VCC  (via drill 0.3)
  Top 0.254: U8.5 30.48,8.56 C23.1 30.73,8.17 30.48,7.91 30.48,7.29 C24.1 30.99,6.9 30.99,6.13 v31.24,5.88 | D8.3 v29.97,4.36
  Top 0.356: J7.P$1 42.16,5.63 42.16,6.39 | 42.16,6.39 42.16,7.77 C30.1 | C29.1 42.16,6.39
  Bottom 0.254: v31.24,5.88 32.77,4.36 | J7.P$1 33.02,4.1 32.77,4.36 | v29.97,4.36 32.77,4.36
LOAD_SW_GATE
  Top 0.356: U4.5 87.7,18.39 89.15,19.85 89.15,20.46 Q2.1
LOAD_SW_MCU  (via drill 0.3)
  Top 0.254: 89.6,12.74 89.6,11.7 R2.2 | U1.15 17.02,25.69 v15.75,26.96 | U4.3 89.6,12.74 | v65.53,25.95 75.44,16.04 80.52,16.04 84.07,12.48 89.34,12.48 89.6,12.74
  Bottom 0.254: v15.75,26.96 25.91,26.96 28.19,29.25 41.15,29.25 48.51,21.88 59.69,21.88 63.75,25.95 v65.53,25.95
N$1
  Top 0.254: U1.43 7.62,27.22 7.11,27.72 6.1,27.72 | 6.1,27.72 4.99,27.72 C11.1 | C12.1 6.1,27.72
N$2
  Top 0.356: U2.3 20.27,4.3 20.83,4.86 C1.1 | U2.3 22.3,4.3 22.61,4.61 C28.1 | D1.3 8.89,5.12 10.16,3.85 10.16,2.83 11.43,1.56 18.03,1.56 18.8,2.32 18.8,4.28 U2.3
N$3
  pour Top (no thermals): 48.77,41.19 54.36,41.19 56.39,39.15 62.23,39.15 62.48,38.9 62.48,36.87 62.23,36.61 59.69,36.61 57.91,34.84 57.91,30.01 58.67,29.25 60.96,29.25 61.72,28.49 61.72,20.87 49.78,20.87 49.78,26.2 48.26,27.72 48.26,40.68
N$5
  pour Top (no thermals): 94.49,47.54 94.49,44.49 92.2,42.2 90.42,40.42 90.42,37.88 91.19,37.12 97.79,37.12 98.04,37.38 98.04,47.28 97.28,48.04 95,48.04
N$6
  Top 0.254: Q3.3 6.52,14.77 R6.1
N$7
  Top 0.305: R4.1 28.62,15.19 Q4.3
RST  (via drill 0.3)
  Top 0.254: U$1.3 v5.59,22.9 | v8.13,28.74 U1.40
  Bottom 0.254: v5.59,22.9 6.1,22.9 7.11,23.91 7.11,27.72 v8.13,28.74
SCL  (via drill 0.3)
  Top 0.254: U5.4 60.89,33.75 v62.23,35.09 63.5,35.09 64.26,34.33 64.26,30.77 63.75,30.26 63.75,25.69 74.93,14.52 80.01,14.52 85.85,8.67 85.85,5.43 U6.4 | 14.22,36.36 14.22,36.87 12.7,38.39 12.7,43.47 | U1.32 12.95,32.55 14.22,33.82 14.22,36.36 | J8.P$1 12.7,43.47 | R8.2 12.7,43.47 | U10.1 12.77,43.41 12.7,43.47 | U7.4 33.15,32.68 v33.78,33.31 | 14.22,36.36 v14.99,36.36
  Bottom 0.254: v62.23,35.09 60.71,33.57 58.93,33.57 58.42,34.07 33.78,34.07 | 33.78,34.07 25.4,34.07 24.64,33.31 18.03,33.31 v14.99,36.36 | v33.78,33.31 33.78,34.07
SDA  (via drill 0.3)
  Top 0.254: U5.6 58.99,34.14 v59.94,35.09 60.71,35.85 63.75,35.85 65.02,34.58 65.02,30.77 64.26,30.01 64.26,26.2 75.18,15.28 80.26,15.28 87.38,8.17 87.38,3.09 87.19,2.9 U6.6 | 16.76,43.47 U10.6 17.71,43.41 17.78,43.47 | J9.P$1 17.78,43.47 | 17.78,43.47 17.78,42.96 | 17.78,42.96 17.78,38.14 | 17.78,38.14 14.73,35.09 14.73,33.57 13.46,32.3 U1.31 | R9.2 17.87,43.05 17.78,42.96 | U7.6 30.36,32.68 29.72,32.04 29.72,31.79 29.97,31.53 34.29,31.53 34.8,32.04 34.8,34.58 34.29,35.09 25.15,35.09 24.89,35.34 | 24.89,35.34 v24.13,36.11 | 17.78,38.14 24.38,38.14 25.15,37.38 25.15,35.6 24.89,35.34
  Bottom 0.254: v59.94,35.09 24.38,35.09 24.13,35.34 v24.13,36.11
SHUNT_P  (via drill 0.3)
  Top 0.254: U1.9 v14.99,24.93 | v96.01,15.53 R3.2
  Route15 0.254: v14.99,24.93 16.26,24.93 16.76,24.42 78.49,24.42 86.11,16.8 92.96,16.8 94.23,15.53 v96.01,15.53
  pour Top (no thermals): 94.23,23.41 96.52,23.41 96.52,19.34 97.79,18.07 97.79,16.55 93.98,16.55 93.98,23.15
SWCLK
  Top 0.254: U1.45 8.13,26.2 7.87,25.95 7.87,23.15 8.13,22.9 9.4,22.9 9.65,22.64 9.65,18.58 9.14,18.07 6.35,18.07 5.59,18.83 U$1.4
SWDIO  (via drill 0.3)
  Top 0.254: U$1.2 6.86,19.6 v7.62,18.83 | U1.46 8.64,25.69 8.38,25.44 8.38,23.66 8.64,23.41 9.91,23.41 10.41,22.9 v10.41,21.88
  Bottom 0.254: v7.62,18.83 10.41,18.83 10.67,19.09 10.67,21.63 v10.41,21.88
USBM
  Top 0.254: J1.2D- 7,43.87 6.6,43.47 6.6,42.2 | 6.6,42.2 6.6,38.9 8.13,37.38 12.95,37.38 13.72,36.61 13.72,34.07 12.45,32.8 U1.33 | U9.6 6.79,42.39 6.6,42.2
USBP
  Top 0.254: J1.3D+ 6.35,43.98 6.1,43.73 6.1,42.2 | 6.1,42.2 6.1,38.65 7.87,36.87 12.7,36.87 13.21,36.36 13.21,34.33 11.94,33.06 U1.34 | U9.1 5.91,42.39 6.1,42.2
VBAT_DIV
  Top 0.254: R6.2 R7.1 16.51,17.06 17.02,17.56 17.02,20.61 16,21.63 U1.11
VBAT_DIVEN  (via drill 0.3)
  Top 0.254: U1.47 11.18,25.18 v11.68,25.69 | v10.16,10.96 8.91,10.96 Q3.1
  Bottom 0.254: v11.68,25.69 10.92,24.93 10.92,23.15 13.21,20.87 13.21,19.6 11.18,17.56 11.18,11.98 v10.16,10.96
VOUT
  Top 0.406: C20.POS 74.68,19.85 | R5.2 32.42,15.02 33.27,15.02 35.56,12.74 45.97,12.74 46.74,13.5 46.74,42.71 48.77,44.74 58.99,44.74 D2.K
  Top 1.829: C20.POS 74.85,20.02 78.99,24.17 78.99,38.82 C19.POS
  pour Top (no thermals): 88.9,44.49 79.76,44.49 76.45,41.19 62.99,41.19 62.74,41.44 61.72,42.46 61.72,48.3 62.48,49.06 88.65,49.06 90.17,47.54 90.17,45.5 89.15,44.49
VOUT_DIV  (via drill 0.3)
  Top 0.254: R4.2 30.23,17.06 v28.7,18.58 | v16.26,19.09 15.49,19.85 U1.10
  Top 0.305: R5.1 R4.2
  Bottom 0.254: v28.7,18.58 16.76,18.58 v16.26,19.09
VOUT_DIVEN  (via drill 0.3)
  Top 0.254: 25.15,17.06 v23.88,17.06 | v11.94,24.68 U1.48
  Top 0.305: Q4.1 25.21,16.99 25.15,17.06
  Bottom 0.254: v23.88,17.06 16.76,17.06 15.49,18.33 15.49,22.39 14.73,23.15 13.46,23.15 v11.94,24.68
(copper drawn outside any net)
  shapes: Top area x4484

### Text on the board
Top: /home/michael/skookumflash/0.5/bluesun2.bmp
tPlace: 3s LiPo | NEG | NEG
bPlace: BLUE SUN OFP | PROTOTYPE v0.5 | THIS DEVICE MAY DEFLAGRATE ANY ATTACHED / CELLS. OPERATE WITH CAUTION. DO NOT / LEAVE UNATTENDED | github.com/OpenFlashlightPlatform
tStop: /home/michael/skookumflash/0.5/bluesun2.bmp